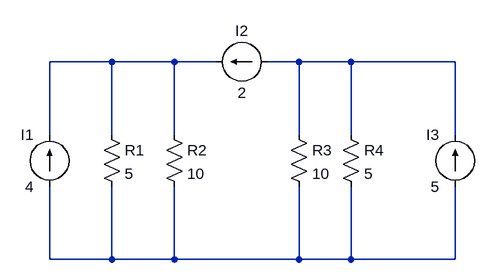
[diagram p0: schematic Draft8.asc]
Draft8.asc, the LTspice schematic file:
Version 4
SHEET 1 880 680
WIRE 144 32 48 32
WIRE 240 32 144 32
WIRE 304 32 240 32
WIRE 432 32 384 32
WIRE 512 32 432 32
WIRE 672 32 512 32
WIRE 48 144 48 32
WIRE 144 144 144 32
WIRE 240 144 240 32
WIRE 432 144 432 32
WIRE 512 144 512 32
WIRE 672 144 672 32
WIRE 48 336 48 224
WIRE 144 336 144 224
WIRE 144 336 48 336
WIRE 240 336 240 224
WIRE 240 336 144 336
WIRE 432 336 432 224
WIRE 432 336 240 336
WIRE 512 336 512 224
WIRE 512 336 432 336
WIRE 672 336 672 224
WIRE 672 336 512 336
SYMBOL current 48 224 R180
WINDOW 0 24 80 Left 2
WINDOW 3 24 0 Left 2
SYMATTR InstName I1
SYMATTR Value 4
SYMBOL res 128 128 R0
SYMATTR InstName R1
SYMATTR Value 5
SYMBOL res 224 128 R0
SYMATTR InstName R2
SYMATTR Value 10
SYMBOL res 416 128 R0
SYMATTR InstName R3
SYMATTR Value 10
SYMBOL res 496 128 R0
SYMATTR InstName R4
SYMATTR Value 5
SYMBOL current 672 224 R180
WINDOW 0 24 80 Left 2
WINDOW 3 24 0 Left 2
SYMATTR InstName I3
SYMATTR Value 5
SYMBOL current 384 32 R90
WINDOW 0 -32 40 VBottom 2
WINDOW 3 32 40 VTop 2
SYMATTR InstName I2
SYMATTR Value 2

The netlist it stands for:
* Draft8.asc
I1 N003 N001 4
R1 N001 N003 5
R2 N001 N003 10
R3 N002 N003 10
R4 N002 N003 5
I3 N003 N002 5
I2 N002 N001 2
.backanno
.end